# EAGLE design Sensor_TCRT5000_board_V_1_0 (EAGLE 9.6.2)
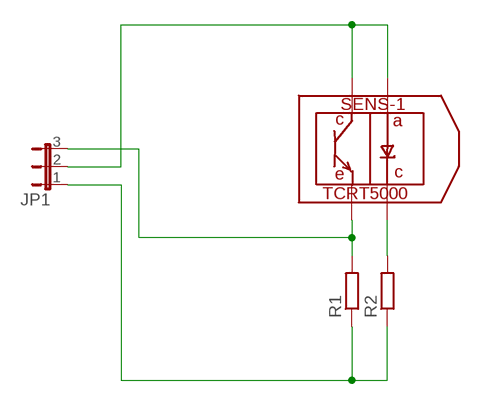
[diagram p0: schematic, sheet 1]

## Parts
JP1  JP2E  [JP2]
R1  R-EU_0309/10  [0309/10]
R2  R-EU_0309/10  [0309/10]
SENS-1  TCRT5000  [5000]

## Nets
N$1: JP1.2 SENS-1.P$1 SENS-1.P$3
N$2: JP1.1 R1.1 R2.1
N$3: R2.2 SENS-1.P$4
N$4: JP1.3 R1.2 SENS-1.P$2

## Library data of the parts
JP1 = jumper:JP2E: JUMPER
R1 R2 = resistor:R-EU_: RESISTOR, European symbol
SENS-1 = qfm-trx1-24g:TCRT5000: Reflective Optical Sensor with Transistor Output. Vishay Semiconductors

## Board
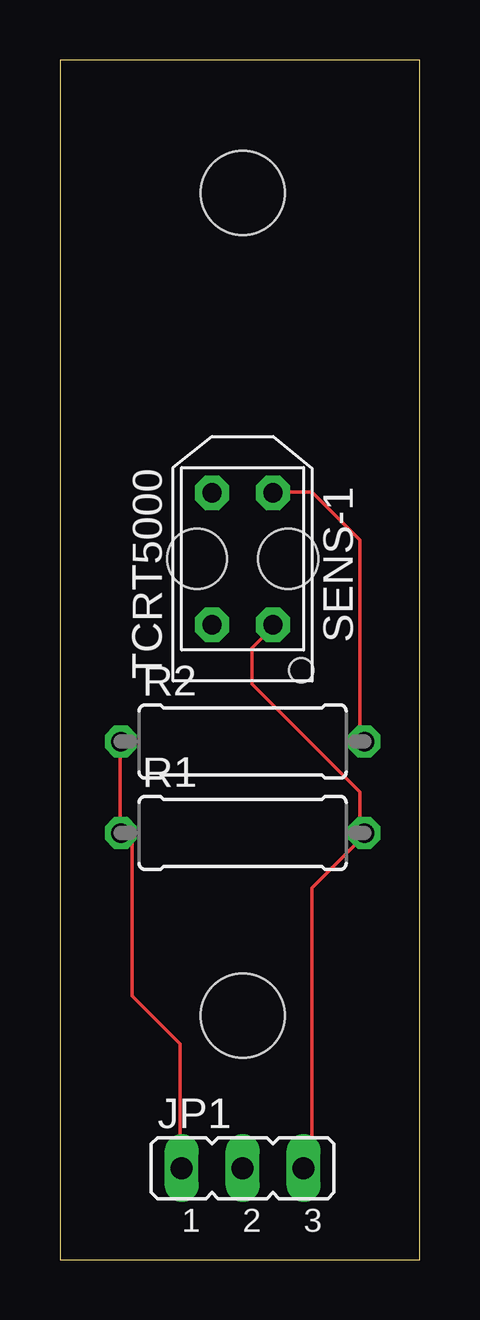
[diagram p1: board, top side]
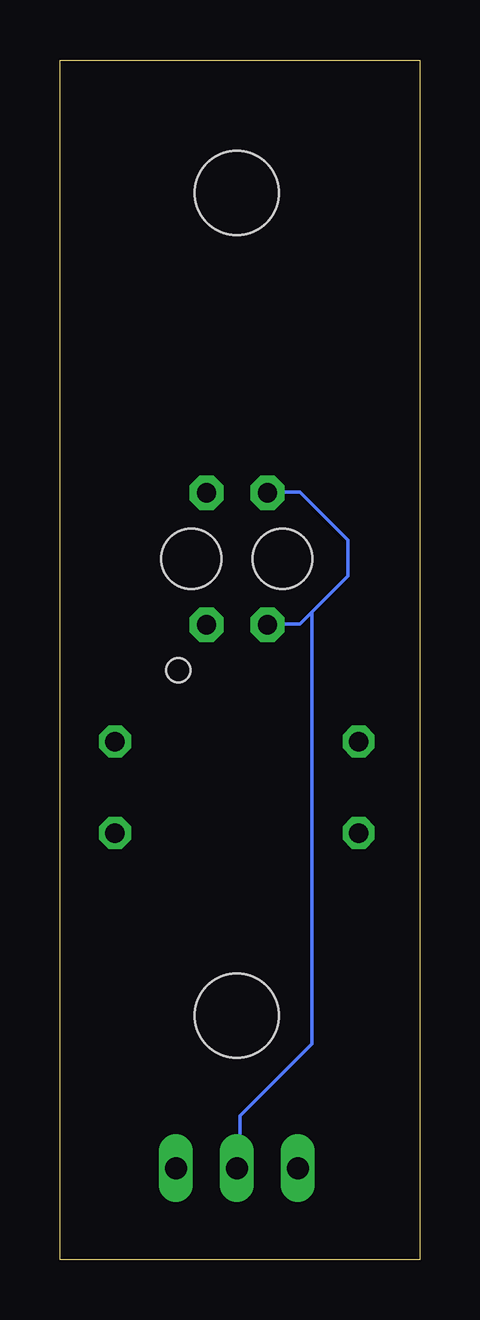
[diagram p2: board, bottom side, seen from below]

Size 15 x 50 mm. Coordinates in mm from the lower left corner, seen from the top.
Outline: 0,0 15,0 15,50 0,50 0,0
Copper layers (1*16): Top 0.035mm / dielectric 1.5mm / Bottom 0.035mm
Design rules "default": minimum track width 6mil, minimum drill 0.35mm, track to track 6mil, track to pad 6mil, pad to pad 6mil, via to via 6mil, smd to smd 6mil, copper to edge 40mil, drill to drill 6mil, minimum pad ring 10mil, minimum via ring 8mil, stop-mask expansion 4mil, vias tented up to drill 0mil, thermal gap 10mil
Holes 3.5 mm at 7.62,44.45 7.62,10.16

### Footprints (pad centres in the part's own frame; a part is rotated, then mirrored left to right if it is on the bottom)
JP2 = drill 0.914 long: 1 -2.54,0; 2 0,0; 3 2.54,0
0309/10 = drill 0.813 octagon: 1 -5.08,0; 2 5.08,0
5000 = drill 0.8 pad 1.422 octagon: P$1 -2.75,1.27; P$2 -2.75,-1.27; P$3 2.75,1.27; P$4 2.75,-1.27 | hole 2.5: 0,1.9; 0,-1.9 | hole 1: -4.65,-2.45

### Placement (x,y rotation side)
JP1  7.62,3.81 0 top
R1  7.62,17.78 0 top
R2  7.62,21.59 0 top
SENS-1  7.62,29.21 90 top

### Tracks (layer width: path | path; a pad name or v marks a point on that pad's centre or on a via)
N$1
  Bottom 0.152: 4.5,27 3,28.5 3,30 5,32 6,32 SENS-1.P$3 | 4.5,27 5,26.5 6,26.5 SENS-1.P$1 | 4.5,27 4.5,9 7.5,6 7.5,4 JP1.2
N$2
  Top 0.152: R2.1 2.5,21.5 2.5,18 R1.1 3,17.5 3,11 5,9 5,4 JP1.1
N$3
  Top 0.152: R2.2 12.5,22 12.5,30 10.5,32 9,32 SENS-1.P$4
N$4
  Top 0.152: SENS-1.P$2 8.5,26 8,25.5 8,24 12.5,19.5 12.5,18 R1.2 12.5,17.5 10.5,15.5 10.5,4 JP1.3